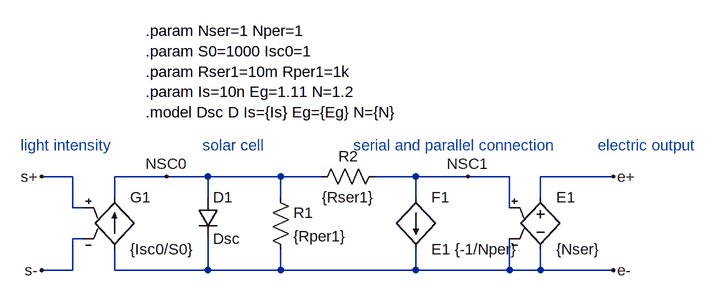
[diagram p0: schematic SolarCells.asc]
SolarCells.asc, the LTspice schematic file:
Version 4
SHEET 1 1584 680
WIRE 208 96 160 96
WIRE 352 96 272 96
WIRE 416 96 352 96
WIRE 528 96 416 96
WIRE 592 96 528 96
WIRE 736 96 672 96
WIRE 816 96 736 96
WIRE 880 96 816 96
WIRE 1040 96 928 96
WIRE 272 128 272 96
WIRE 416 128 416 96
WIRE 528 128 528 96
WIRE 736 128 736 96
WIRE 928 128 928 96
WIRE 208 144 208 96
WIRE 224 144 208 144
WIRE 880 144 880 96
WIRE 224 192 208 192
WIRE 208 240 208 192
WIRE 208 240 160 240
WIRE 272 240 272 208
WIRE 416 240 416 192
WIRE 416 240 272 240
WIRE 528 240 528 208
WIRE 528 240 416 240
WIRE 736 240 736 208
WIRE 736 240 528 240
WIRE 880 240 880 192
WIRE 880 240 736 240
WIRE 928 240 928 208
WIRE 928 240 880 240
WIRE 1040 240 928 240
FLAG 1040 96 e+
FLAG 160 96 s+
FLAG 816 96 NSC1
FLAG 352 96 NSC0
FLAG 160 240 s-
FLAG 1040 240 e-
SYMBOL g 272 112 R0
SYMATTR InstName G1
SYMATTR Value {Isc0/S0}
SYMBOL diode 400 128 R0
SYMATTR InstName D1
SYMATTR Value Dsc
SYMBOL res 512 112 R0
SYMATTR InstName R1
SYMATTR Value {Rper1}
SYMBOL res 688 80 R90
WINDOW 0 0 56 VBottom 2
WINDOW 3 32 56 VTop 2
SYMATTR InstName R2
SYMATTR Value {Rser1}
SYMBOL e 928 112 R0
SYMATTR InstName E1
SYMATTR Value {Nser}
SYMBOL f 736 128 R0
SYMATTR InstName F1
SYMATTR Value E1 {-1/Nper}
TEXT 320 -128 Left 2 !.param Nser=1 Nper=1\n.param S0=1000 Isc0=1\n.param Rser1=10m Rper1=1k\n.param Is=10n Eg=1.11 N=1.2\n.model Dsc D Is={Is} Eg={Eg} N={N}
TEXT 128 48 Left 2 ;light intensity
TEXT 408 48 Left 2 ;solar cell
TEXT 1016 48 Left 2 ;electric output
TEXT 640 48 Left 2 ;serial and parallel connection

The netlist it stands for:
* SolarCells.asc
G1 e- NSC0 s+ s- {Isc0/S0}
D1 NSC0 e- Dsc
R1 NSC0 e- {Rper1}
R2 NSC1 NSC0 {Rser1}
E1 e+ e- NSC1 e- {Nser}
F1 NSC1 e- E1 {-1/Nper}
.model D D
.lib standard.dio
.param Nser=1 Nper=1
.param S0=1000 Isc0=1
.param Rser1=10m Rper1=1k
.param Is=10n Eg=1.11 N=1.2
.model Dsc D Is={Is} Eg={Eg} N={N}
* light intensity
* solar cell
* electric output
* serial and parallel connection
.backanno
.end